# EAGLE board Proiect (EAGLE 9.7.0)
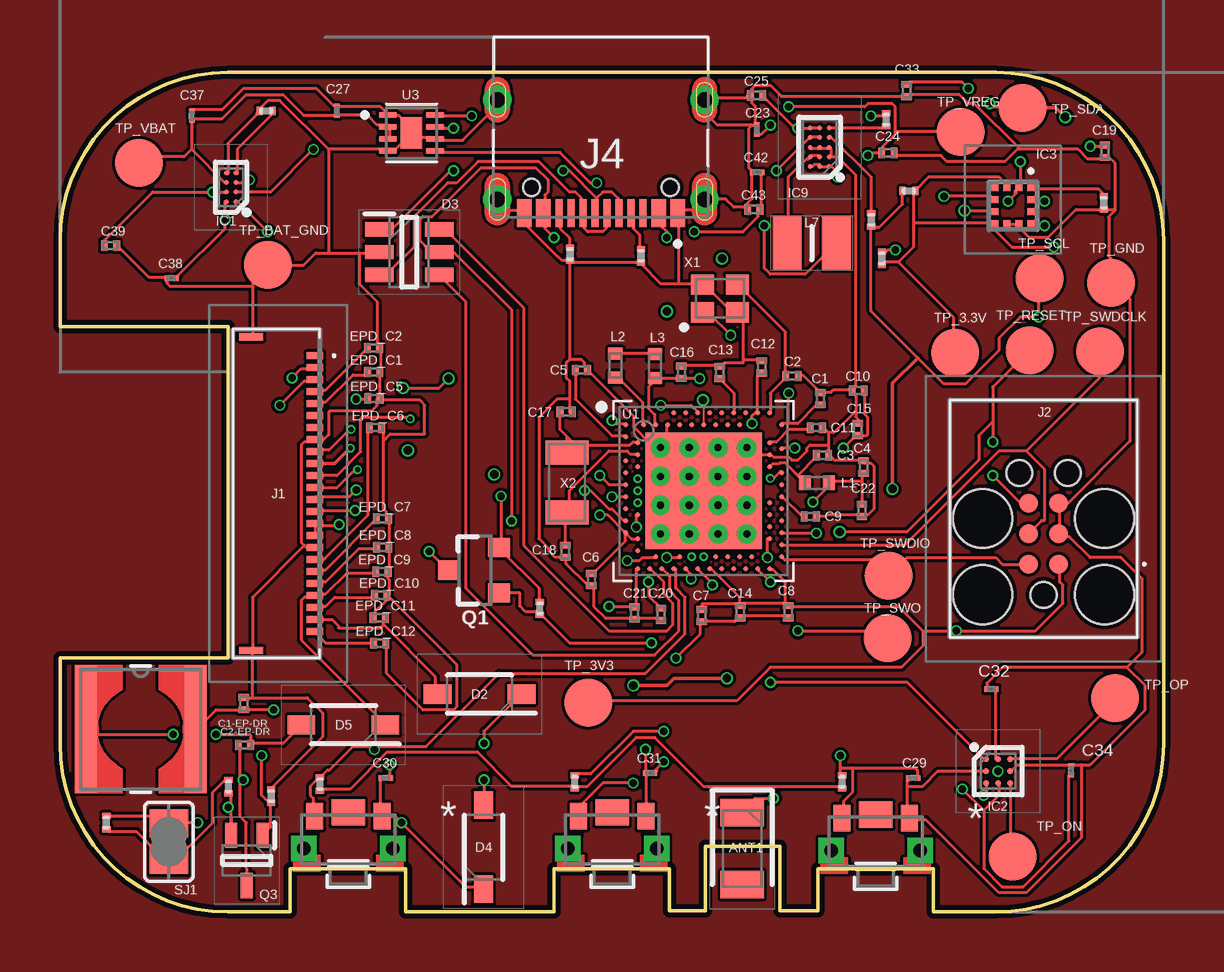
[diagram p2: board, top side]
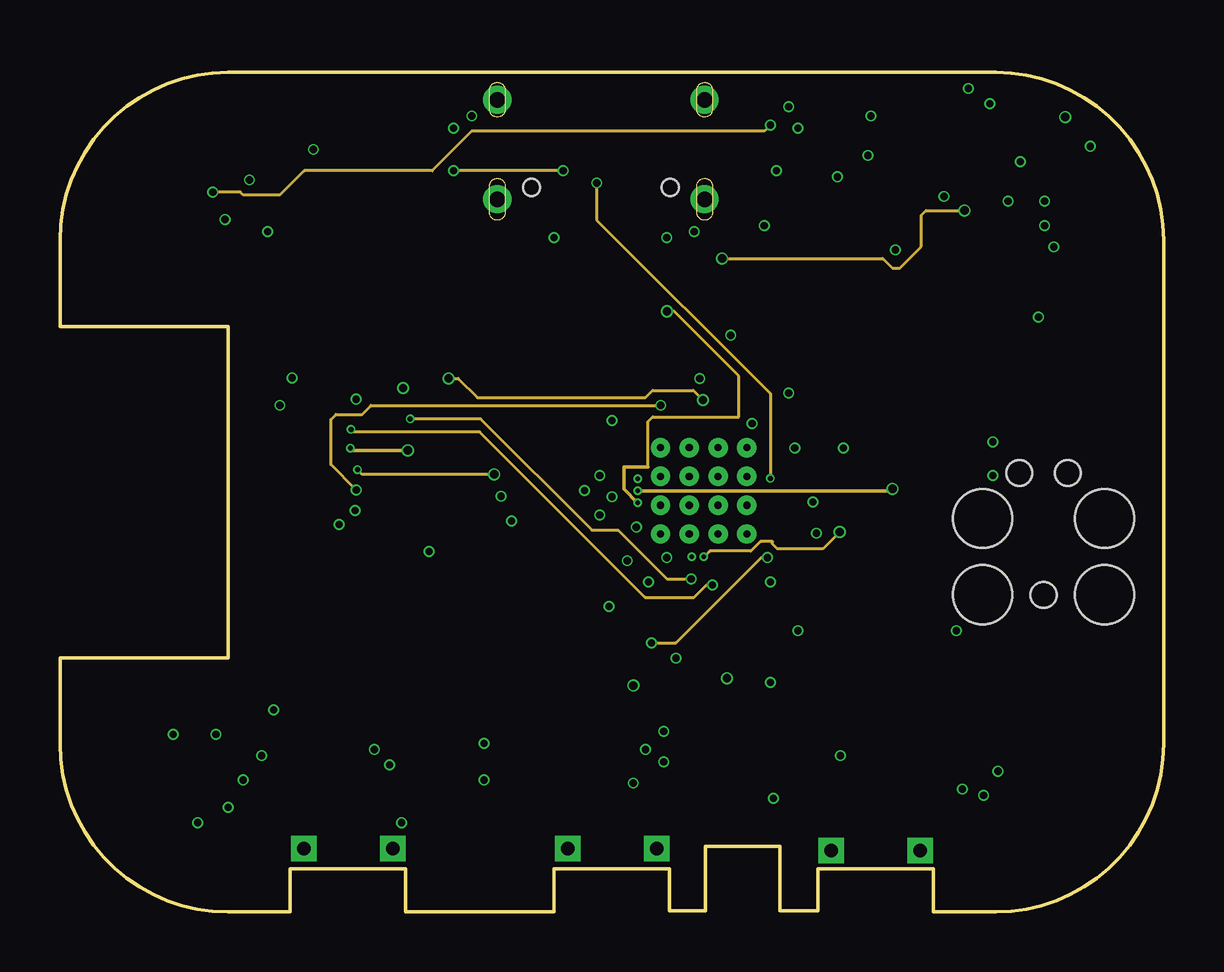
[diagram p3: board, inner layer Route2]
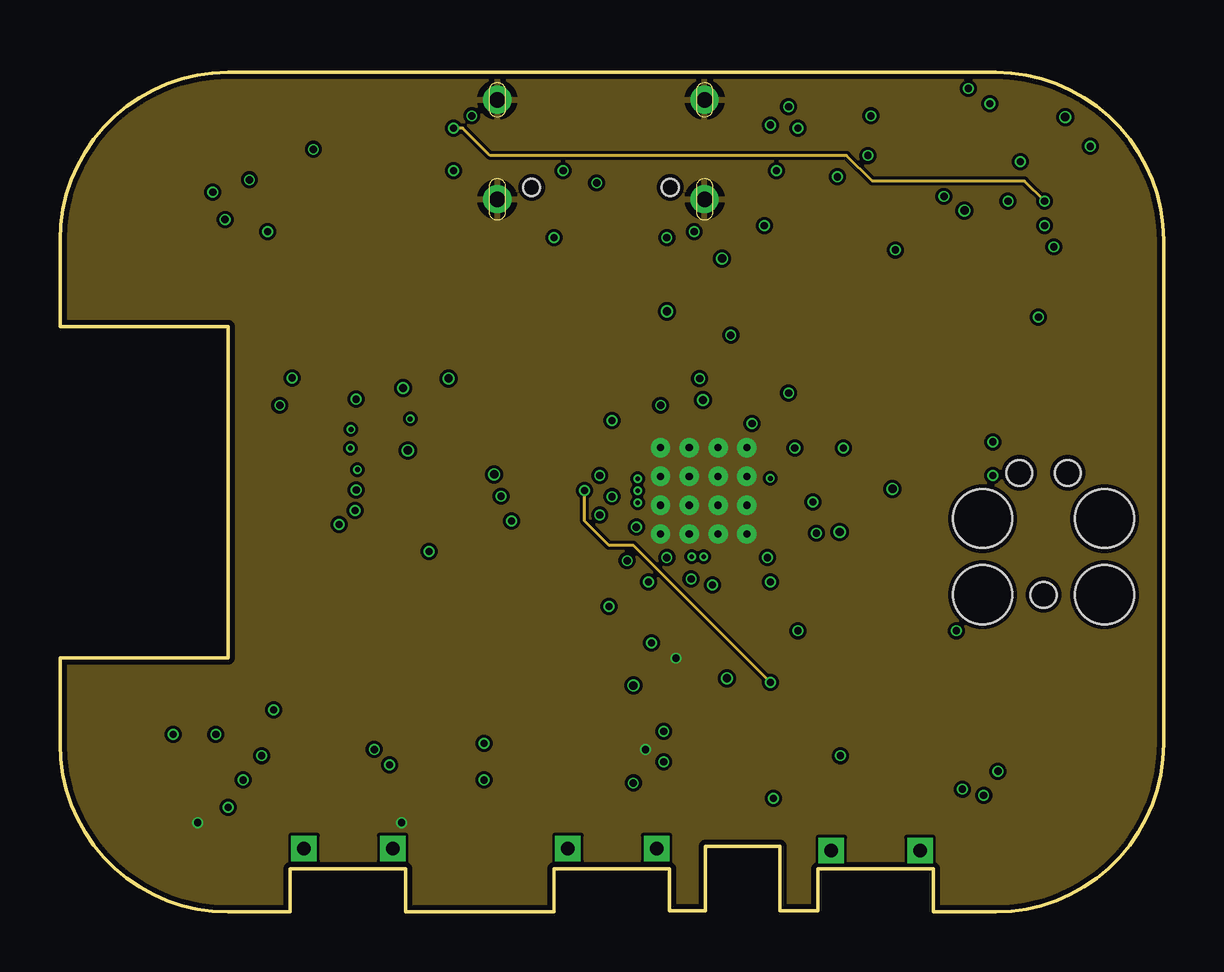
[diagram p4: board, inner layer Route15]
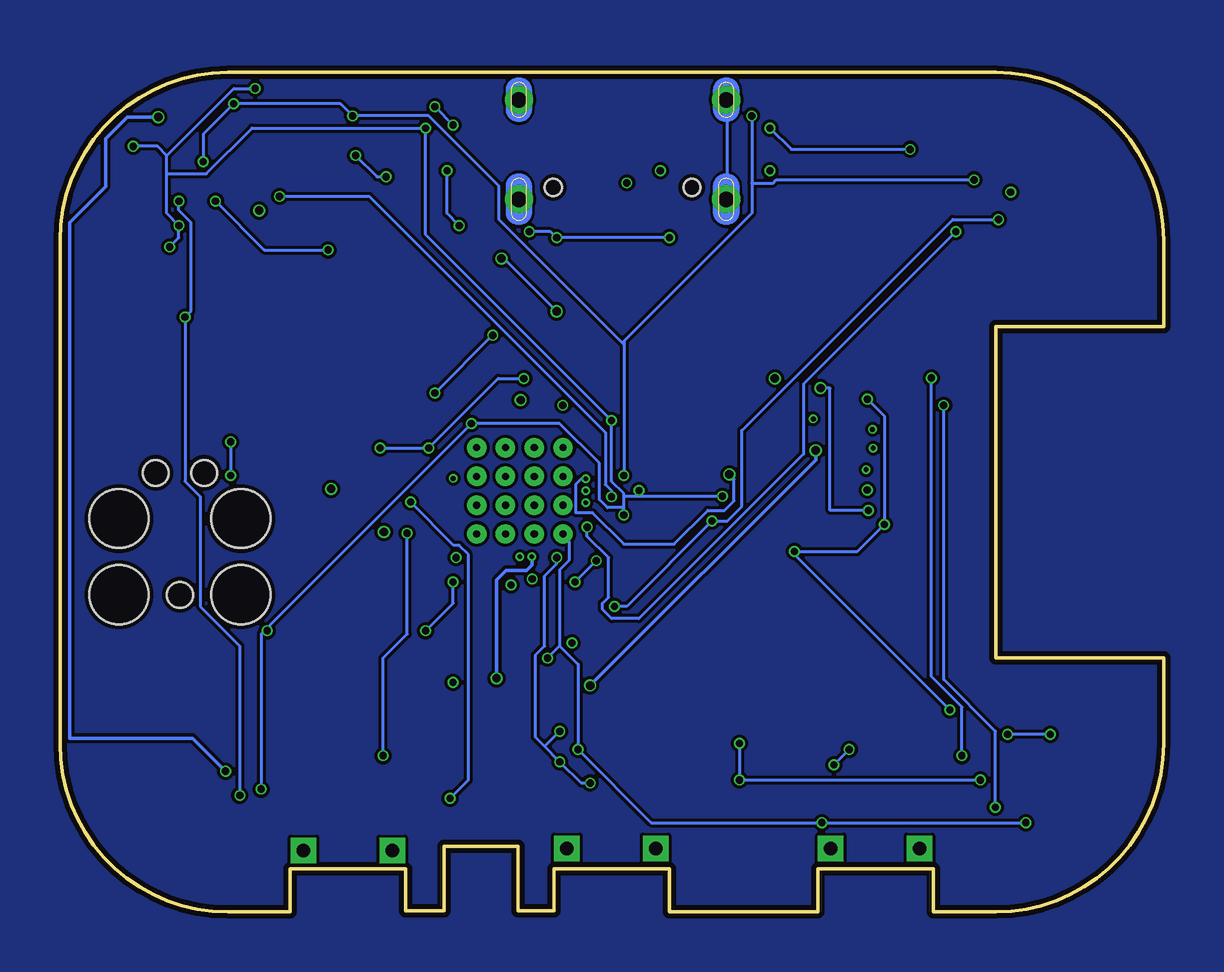
[diagram p5: board, bottom side, seen from below]

Size 46 x 35 mm. Coordinates in mm from the lower left corner, seen from the top.
Outline: 39,0 36.4,0 36.4,1.8 31.6,1.8 31.6,0.04 30,0.04 30,2.74 26.9,2.74 26.9,0.04 25.4,0.04 25.4,1.8 20.6,1.8 20.6,0 14.4,0 14.4,1.8 9.6,1.8 9.6,0 7,0 arc-90 0,7 0,10.6 7,10.6 7,24.4 0,24.4 0,28 arc-90 7,35 39,35 arc-90 46,28 46,7 arc-90 39,0
Copper layers (1+2*15+16): Top 0.035mm / dielectric 1.6mm / Route2 0.035mm / dielectric 0.15mm / Route15 0.035mm / dielectric 0.2mm / Bottom 0.035mm
Design rules "jlcpcb-2layers.dru *": minimum track width 5mil, minimum drill 0.3mm, track to track 5mil, track to pad 5mil, pad to pad 5mil, via to via 5mil, smd to smd 5mil, copper to edge 0.2mm, drill to drill 6mil, minimum pad ring 10mil, minimum via ring 3mil, stop-mask expansion 4mil, vias tented up to drill 0mil, thermal gap 10mil

## Footprints (pad centres in the part's own frame; a part is rotated, then mirrored left to right if it is on the bottom)
2450AT18B100E_ANTC3216X140N = smd 1.15 x 1.8: 1 -1.5,0; 2 1.5,0
NORDIC_NRF_3_RESC0201_L = smd 0.28 x 0.43: 1 -0.255,0; 2 0.255,0
GRM011R60J152KE01L_2_CAPC0201X13N = smd 0.22 x 0.23: 1 -0.185,0; 2 0.185,0
ESP32_C6_LIBRARY_5_SOD3716X135N = smd 1.15 x 0.8: 1 -1.75,0; 2 1.75,0
ESP32_C6_LIBRARY_3_SOT95P280X145-6N = smd 1.2 x 0.6: 1 -1.25,0.95; 2 -1.25,0; 3 -1.25,-0.95; 4 1.25,-0.95; 5 1.25,0; 6 1.25,0.95
BQ25180YBGR_BGA8C40P2X4_100X155X50 = smd 0.2 x 0.2: A1 -0.2,0.6; A2 0.2,0.6; B1 -0.2,0.2; B2 0.2,0.2; C1 -0.2,-0.2; C2 0.2,-0.2; D1 -0.2,-0.6; D2 0.2,-0.6
DRV2605YZFR_BGA9C50P3X3_144X144X62 = smd 0.25 x 0.25: A1 -0.5,0.5; A2 0,0.5; A3 0.5,0.5; B1 -0.5,0; B2 0,0; B3 0.5,0; C1 -0.5,-0.5; C2 0,-0.5; C3 0.5,-0.5
BMA423_BMA423 = smd 0.3 x 0.35: 1 -0.75,-0.775; 2 -0.25,-0.775; 3 0.25,-0.775; 4 0.75,-0.775; 7 0.75,0.775; 8 0.25,0.775; 9 -0.25,0.775; 10 -0.75,0.775 | smd 0.35 x 0.3: 5 0.775,-0.25; 6 0.775,0.25; 11 -0.775,0.25; 12 -0.775,-0.25
RT6160AWSC_BGA15C40P3X5_140X230X60 = smd 0.216 x 0.216: A1 -0.4,0.8; A2 0,0.8; A3 0.4,0.8; B1 -0.4,0.4; B2 0,0.4; B3 0.4,0.4; C1 -0.4,0; C2 0,0; C3 0.4,0; D1 -0.4,-0.4; D2 0,-0.4; D3 0.4,-0.4; E1 -0.4,-0.8; E2 0,-0.8; E3 0.4,-0.8
503480-2400_5034802400 = smd 0.3 x 0.7: 1 -5.75,1.525; 2 -5.25,1.525; 3 -4.75,1.525; 4 -4.25,1.525; 5 -3.75,1.525; 6 -3.25,1.525; 7 -2.75,1.525; 8 -2.25,1.525; 9 -1.75,1.525; 10 -1.25,1.525; 11 -0.75,1.525; 12 -0.25,1.525; 13 0.25,1.525; 14 0.75,1.525; 15 1.25,1.525; 16 1.75,1.525; 17 2.25,1.525; 18 2.75,1.525; 19 3.25,1.525; 20 3.75,1.525; 21 4.25,1.525; 22 4.75,1.525; 23 5.25,1.525; 24 5.75,1.525 | smd 0.3 x 1: MP1 -6.54,-1.125; MP2 6.54,-1.125
TC2030-IDC_TC2030IDC = smd 0.783 x 0.783: 1 -0.953,-0.635; 2 -0.953,0.635; 3 0.317,-0.635; 4 0.317,0.635; 5 1.588,-0.635; 6 1.588,0.635 | hole 2.451: -2.223,-2.54; -2.223,2.54; 0.952,-2.54; 0.952,2.54 | hole 1.067: -2.223,0; 2.857,-1.016; 2.857,1.016
KH-TYPE-C-16P_KINGHELM_KH-TYPE-C-16P = smd 0.6 x 1.15: A1_B12 -3.2,4.725; A4_B9 -2.4,4.725; A9_B4 2.4,4.725; A12_B1 3.2,4.725 | smd 0.3 x 1.15: A5 -1.25,4.725; A6 -0.25,4.725; A7 0.25,4.725; A8 1.25,4.725; B5 1.75,4.725; B6 0.75,4.725; B7 -0.75,4.725; B8 -1.75,4.725 | drill 0.65 pad 1.05: SH1 -4.32,0; SH2 4.32,0; SH3 -4.32,4.15; SH4 4.32,4.15 | hole 0.7: -2.89,3.65; 2.89,3.65
NORDIC_NRF_2_RESC0402_L = smd 0.5 x 0.6: 1 -0.5,0; 2 0.5,0
ESP32_C6_LIBRARY_2_IND_4828-WE-TPC_WRE = smd 0.9 x 5.3: 1 -2.286,0; 2 2.286,0
MLP2016SR47MT0S1_INDC2016X100N = smd 1.2 x 2.2: 1 -1.028,0; 2 1.028,0
ESP32_C6_LIBRARY_4_ESP32_C6_LIBRARY_4_ESP32_C6_LIBRARY_4_ESP32_C6_LIBRARY_4_ESP32_WROVER_SPARKFUN-DISCRETESEMI_SOT23-3 = smd 0.8 x 0.9: 1 -0.95,-1; 2 0.95,-1; 3 0,1.1
ESP32_C6_LIBRARY_6_SOT65P210X110-3N = smd 1.05 x 0.5: 1 -1.05,0.65; 2 -1.05,-0.65; 3 1.05,0
ERA-1AEB3401C_0201 = smd 0.35 x 0.25: 1 0,0.275; 2 0,-0.275
ESP32_C6_LIBRARY_7_JUMPER_SJ = smd 1.168 x 1.6: 1 -0.762,0; 2 0.762,0
2025-10-22_07-23-44_LIBRARY_SW_EVP-AKE31A_PAN = smd 0.711 x 1.092: 1 -1.4,-0.972; 2 1.4,-0.972 | drill 0.559 pad 0.914 square: 3 -1.848,0.381; 4 1.848,0.381 | smd 1.397 x 1.092: 5 0,-1.124
HECTOR_WATCH_1_TP20R = smd 2 x 2: TP 0,0
NORDIC_NRF_4_AQFN50P700X700X85_HS-74N = smd 4.85 x 4.85: P$74 0,0 | drill 0.3 pad 0.6: P$75 -1.8,1.8; P$76 -0.6,1.8; P$77 0.6,1.8; P$78 1.8,1.8; P$79 -1.8,0.6; P$80 -0.6,0.6; P$81 0.6,0.6; P$82 1.8,0.6; P$83 -1.8,-0.6; P$84 -0.6,-0.6; P$85 0.6,-0.6; P$86 1.8,-0.6; P$87 -1.8,-1.8; P$88 -0.6,-1.8; P$89 0.6,-1.8; P$90 1.8,-1.8 | smd 0.2 x 0.2: P$A8 -1.25,3.25; P$A10 -0.75,3.25; P$A12 -0.25,3.25; P$A14 0.25,3.25; P$A16 0.75,3.25; P$A18 1.25,3.25; P$A20 1.75,3.25; P$A22 2.25,3.25; P$A23 2.75,3.25; P$AA24 3.25,-2.25; P$AB2 -2.75,-2.5; P$AC5 -2,-2.75; P$AC9 -1,-2.75; P$AC11 -0.5,-2.75; P$AC13 0,-2.75; P$AC15 0.5,-2.75; P$AC17 1,-2.75; P$AC19 1.5,-2.75; P$AC21 2,-2.75; P$AC24 3.25,-2.75; P$AD2 -2.75,-3.25; P$AD4 -2.25,-3.25; P$AD6 -1.75,-3.25; P$AD8 -1.25,-3.25; P$AD10 -0.75,-3.25; P$AD12 -0.25,-3.25; P$AD14 0.25,-3.25; P$AD16 0.75,-3.25; P$AD18 1.25,-3.25; P$AD20 1.75,-3.25; P$AD22 2.25,-3.25; P$AD23 2.75,-3.25; P$B1 -3.25,2.75; P$B3 -2.5,2.75; P$B5 -2,2.75; P$B7 -1.5,2.75; P$B9 -1,2.75; P$B11 -0.5,2.75; P$B13 0,2.75; P$B15 0.5,2.75; P$B17 1,2.75; P$B19 1.5,2.75; P$B24 3.25,2.75; P$C1 -3.25,2.25; P$D2 -2.75,2; P$D23 2.75,2; P$E24 3.25,1.75; P$F2 -2.75,1.5; P$F23 2.75,1.5; P$G1 -3.25,1.25; P$H2 -2.75,1; P$H23 2.75,1; P$J1 -3.25,0.75; P$J24 3.25,0.75; P$K2 -2.75,0.5; P$L1 -3.25,0.25; P$L24 3.25,0.25; P$M2 -2.75,0; P$N1 -3.25,-0.25; P$N24 3.25,-0.25; P$P2 -2.75,-0.5; P$P23 2.75,-0.5; P$R1 -3.25,-0.75; P$R24 3.25,-0.75; P$T2 -2.75,-1; P$T23 2.75,-1; P$U1 -3.25,-1.25; P$U24 3.25,-1.25; P$V23 2.75,-1.5; P$W1 -3.25,-1.75; P$W24 3.25,-1.75; P$Y2 -2.75,-2; P$Y23 2.75,-2
ESP32_C6_LIBRARY_SON50P200X200X80-9N = smd 0.76 x 0.27: 1 -0.985,0.75; 2 -0.985,0.25; 3 -0.985,-0.25; 4 -0.985,-0.75; 5 0.985,-0.75; 6 0.985,-0.25; 7 0.985,0.25; 8 0.985,0.75 | smd 0.9 x 1.3: 9 0,0
NORDIC_NRF_BT-XTAL_2016_N = smd 0.95 x 0.85: 1 -0.725,-0.575; 2 0.725,-0.575; 3 0.725,0.575; 4 -0.725,0.575
NORDIC_NRF_1_XTAL_3215_N = smd 1 x 1.8: 1 -1.25,0; 2 1.25,0

## Placement (x,y rotation side)
ANT1  2450AT18B100E_2450AT18B100E  [2450AT18B100E_ANTC3216X140N]  28.44,2.64 270 top
C1  12pF  [NORDIC_NRF_3_RESC0201_L]  31.7,21.4 90 top
C1-EP-DR  10uF  [NORDIC_NRF_3_RESC0201_L]  7.67,8.69 90 top
C2  12pF  [NORDIC_NRF_3_RESC0201_L]  30.51,22.34 0 top
C2-EP-DR  4.7uF/25V  [NORDIC_NRF_3_RESC0201_L]  7.69,6.97 0 top
C3  1pF  [NORDIC_NRF_3_RESC0201_L]  31.79,19.04 0 top
C4  1pF  [NORDIC_NRF_3_RESC0201_L]  33.5,18.55 90 top
C5  100µF  [NORDIC_NRF_3_RESC0201_L]  21.73,22.59 0 top
C6  4.7µF  [NORDIC_NRF_3_RESC0201_L]  22.15,13.86 270 top
C7  100µF  [NORDIC_NRF_3_RESC0201_L]  26.75,12.36 270 top
C8  100µF  [NORDIC_NRF_3_RESC0201_L]  30.35,12.51 270 top
C9  820pF  [NORDIC_NRF_3_RESC0201_L]  31.28,16.49 0 top
C10  N.C  [NORDIC_NRF_3_RESC0201_L]  33.27,21.74 180 top
C11  100nF  [NORDIC_NRF_3_RESC0201_L]  31.53,20.19 0 top
C12  100nF  [NORDIC_NRF_3_RESC0201_L]  29.25,22.72 90 top
C13  N.C.  [NORDIC_NRF_3_RESC0201_L]  27.5,22.49 90 top
C14  4.7µF  [NORDIC_NRF_3_RESC0201_L]  28.35,12.51 270 top
C15  1.0µF  [NORDIC_NRF_3_RESC0201_L]  33.25,20.12 90 top
C16  47nF  [NORDIC_NRF_3_RESC0201_L]  25.9,22.5 90 top
C17  12µF  [NORDIC_NRF_3_RESC0201_L]  21.1,20.85 180 top
C18  12µF  [NORDIC_NRF_3_RESC0201_L]  21.06,15.04 90 top
C19  100uF  [NORDIC_NRF_3_RESC0201_L]  43.55,31.71 270 top
C20  4.7µF  [NORDIC_NRF_3_RESC0201_L]  25.05,12.41 270 top
C21  4.7µF  [NORDIC_NRF_3_RESC0201_L]  23.95,12.46 270 top
C22  N.C.  [NORDIC_NRF_3_RESC0201_L]  33.43,16.74 270 top
C23  GRM011R60J152KE01L_2_GRM011R60J152KE01L  [GRM011R60J152KE01L_2_CAPC0201X13N]  29.05,32.62 270 top
C24  10uF  [NORDIC_NRF_3_RESC0201_L]  34.51,31.64 180 top
C25  22uF  [NORDIC_NRF_3_RESC0201_L]  29.04,34.04 180 top
C27  GRM011R60J152KE01L_2_GRM011R60J152KE01L  [GRM011R60J152KE01L_2_CAPC0201X13N]  11.55,33.4 270 top
C29  GRM011R60J152KE01L_2_GRM011R60J152KE01L  [GRM011R60J152KE01L_2_CAPC0201X13N]  35.56,5.59 0 top
C30  GRM011R60J152KE01L_2_GRM011R60J152KE01L  [GRM011R60J152KE01L_2_CAPC0201X13N]  13.58,5.59 0 top
C31  GRM011R60J152KE01L_2_GRM011R60J152KE01L  [GRM011R60J152KE01L_2_CAPC0201X13N]  24.6,5.79 0 top
C32  GRM011R60J152KE01L_2_GRM011R60J152KE01L  [GRM011R60J152KE01L_2_CAPC0201X13N]  38.82,9.29 0 top
C33  22uF  [NORDIC_NRF_3_RESC0201_L]  35.29,34.24 270 top
C34  GRM011R60J152KE01L_2_GRM011R60J152KE01L  [GRM011R60J152KE01L_2_CAPC0201X13N]  42.15,5.9 270 top
C37  GRM011R60J152KE01L_2_GRM011R60J152KE01L  [GRM011R60J152KE01L_2_CAPC0201X13N]  5.49,33.19 270 top
C38  GRM011R60J152KE01L_2_GRM011R60J152KE01L  [GRM011R60J152KE01L_2_CAPC0201X13N]  4.65,26.41 0 top
C39  10µF  [NORDIC_NRF_3_RESC0201_L]  2.11,27.78 0 top
C42  GRM011R60J152KE01L_2_GRM011R60J152KE01L  [GRM011R60J152KE01L_2_CAPC0201X13N]  29.06,30.83 0 top
C43  4.7uF  [NORDIC_NRF_3_RESC0201_L]  28.92,29.29 180 top
D2  ESP32_C6_LIBRARY_5_MBR0530  [ESP32_C6_LIBRARY_5_SOD3716X135N]  17.49,9.08 180 top
D3  ESP32_C6_LIBRARY_3_USBLC6-2SC6Y  [ESP32_C6_LIBRARY_3_SOT95P280X145-6N]  14.56,27.51 0 top
D4  ESP32_C6_LIBRARY_5_MBR0530  [ESP32_C6_LIBRARY_5_SOD3716X135N]  17.66,2.7 90 top
D5  ESP32_C6_LIBRARY_5_MBR0530  [ESP32_C6_LIBRARY_5_SOD3716X135N]  11.82,7.8 180 top
EPD_C1  1uF/50V  [NORDIC_NRF_3_RESC0201_L]  13.08,22.51 180 top
EPD_C2  1uF/50V  [NORDIC_NRF_3_RESC0201_L]  13.07,23.51 180 top
EPD_C5  0.1uF/50V  [NORDIC_NRF_3_RESC0201_L]  13.09,21.41 180 top
EPD_C6  1uF/50V  [NORDIC_NRF_3_RESC0201_L]  13.15,20.19 180 top
EPD_C7  1uF/50V  [NORDIC_NRF_3_RESC0201_L]  13.44,16.39 180 top
EPD_C8  1uF/50V  [NORDIC_NRF_3_RESC0201_L]  13.45,15.21 180 top
EPD_C9  1uF/50V  [NORDIC_NRF_3_RESC0201_L]  13.42,14.19 180 top
EPD_C10  1uF/50V  [NORDIC_NRF_3_RESC0201_L]  13.37,13.21 180 top
EPD_C11  1uF/50V  [NORDIC_NRF_3_RESC0201_L]  13.31,12.27 0 top
EPD_C12  1uF/50V  [NORDIC_NRF_3_RESC0201_L]  13.33,11.21 180 top
IC1  BQ25180YBGR_BQ25180YBGR  [BQ25180YBGR_BGA8C40P2X4_100X155X50]  7.13,30.21 180 top
IC2  DRV2605YZFR_DRV2605YZFR  [DRV2605YZFR_BGA9C50P3X3_144X144X62]  39.1,5.87 0 top
IC3  BMA423_BMA423  [BMA423_BMA423]  39.72,29.44 180 top
IC9  RT6160AWSC_RT6160AWSC  [RT6160AWSC_BGA15C40P3X5_140X230X60]  31.67,31.88 180 top
J1  503480-2400_503480-2400  [503480-2400_5034802400]  9.1,17.44 270 top
J2  TC2030-IDC_TC2030-IDC  [TC2030-IDC_TC2030IDC]  41,15.45 90 top
J4  KH-TYPE-C-16P_KH-TYPE-C-16P  [KH-TYPE-C-16P_KINGHELM_KH-TYPE-C-16P]  22.55,33.86 180 top
L1  3.9nH  [NORDIC_NRF_2_RESC0402_L]  31.56,17.89 0 top
L2  10µH  [NORDIC_NRF_2_RESC0402_L]  23.15,22.77 90 top
L3  15nH  [NORDIC_NRF_2_RESC0402_L]  24.8,22.75 270 top
L5  ESP32_C6_LIBRARY_2_744043680IND_4828-WE-TPC_WRE  [ESP32_C6_LIBRARY_2_IND_4828-WE-TPC_WRE]  3.37,7.62 0 top
L7  MLP2016SR47MT0S1_FTC252012SR47MBCA  [MLP2016SR47MT0S1_INDC2016X100N]  31.34,27.88 0 top
Q1  20V/4.2A/52mΩ/1.4W  [ESP32_C6_LIBRARY_4_ESP32_C6_LIBRARY_4_ESP32_C6_LIBRARY_4_ESP32_C6_LIBRARY_4_ESP32_WROVER_SPARKFUN-DISCRETESEMI_SOT23-3]  17.3,14.25 90 top
Q3  ESP32_C6_LIBRARY_6_SI1308EDL-T1-GE3  [ESP32_C6_LIBRARY_6_SOT65P210X110-3N]  7.79,2.15 270 top
R1_EP_DR  ERA-1AEB3401C_CPF0201D7K68C1  [ERA-1AEB3401C_0201]  7.02,5.23 0 top
R1_USB  ERA-1AEB3401C_CPF0201D7K68C1  [ERA-1AEB3401C_0201]  24.22,27.35 180 top
R2  ERA-1AEB3401C_CPF0201D7K68C1  [ERA-1AEB3401C_0201]  34.44,33.03 0 top
R2_EP_DR1  ERA-1AEB3401C_CPF0201D7K68C1  [ERA-1AEB3401C_0201]  8.8,4.83 0 top
R2_USB  ERA-1AEB3401C_CPF0201D7K68C1  [ERA-1AEB3401C_0201]  21.26,27.43 0 top
R3  ERA-1AEB3401C_CPF0201D7K68C1  [ERA-1AEB3401C_0201]  43.51,29.56 180 top
R4  ERA-1AEB3401C_CPF0201D7K68C1  [ERA-1AEB3401C_0201]  33.82,28.85 180 top
R5  ERA-1AEB3401C_CPF0201D7K68C1  [ERA-1AEB3401C_0201]  10.84,5.33 0 top
R7  ERA-1AEB3401C_CPF0201D7K68C1  [ERA-1AEB3401C_0201]  32.6,5.43 0 top
R8  ERA-1AEB3401C_CPF0201D7K68C1  [ERA-1AEB3401C_0201]  21.46,5.43 0 top
R9  ERA-1AEB3401C_CPF0201D7K68C1  [ERA-1AEB3401C_0201]  8.59,33.4 90 top
R17  ERA-1AEB3401C_CPF0201D7K68C1  [ERA-1AEB3401C_0201]  35.39,30.06 270 top
R18  ERA-1AEB3401C_CPF0201D7K68C1  [ERA-1AEB3401C_0201]  34.26,27.25 180 top
R_PWR_EPD  ERA-1AEB3401C_CPF0201D7K68C1  [ERA-1AEB3401C_0201]  20,12.65 180 top
R_TYPE_SEL  ERA-1AEB3401C_CPF0201D7K68C1  [ERA-1AEB3401C_0201]  1.93,3.73 0 top
SJ1  [ESP32_C6_LIBRARY_7_JUMPER_SJ]  4.54,2.93 270 top
SW_DN  2025-10-22_07-23-44_LIBRARY_EVP-AKE31ASW_EVP-AKE31A_PAN  [2025-10-22_07-23-44_LIBRARY_SW_EVP-AKE31A_PAN]  34,2.94 180 top
SW_ENT  2025-10-22_07-23-44_LIBRARY_EVP-AKE31ASW_EVP-AKE31A_PAN  [2025-10-22_07-23-44_LIBRARY_SW_EVP-AKE31A_PAN]  23.02,3.03 180 top
SW_UP  2025-10-22_07-23-44_LIBRARY_EVP-AKE31ASW_EVP-AKE31A_PAN  [2025-10-22_07-23-44_LIBRARY_SW_EVP-AKE31A_PAN]  12.02,3.03 180 top
TP_3.3V  HECTOR_WATCH_1_TPTP20R  [HECTOR_WATCH_1_TP20R]  37.32,23.32 0 top
TP_3V3  HECTOR_WATCH_1_TPTP20R  [HECTOR_WATCH_1_TP20R]  22.02,8.72 0 top
TP_BAT_GND  HECTOR_WATCH_1_TPTP20R  [HECTOR_WATCH_1_TP20R]  8.66,26.97 0 top
TP_GND  HECTOR_WATCH_1_TPTP20R  [HECTOR_WATCH_1_TP20R]  43.81,26.22 0 top
TP_ON  HECTOR_WATCH_1_TPTP20R  [HECTOR_WATCH_1_TP20R]  39.7,2.32 0 top
TP_OP  HECTOR_WATCH_1_TPTP20R  [HECTOR_WATCH_1_TP20R]  43.98,8.92 0 top
TP_RESET  HECTOR_WATCH_1_TPTP20R  [HECTOR_WATCH_1_TP20R]  40.41,23.42 0 top
TP_SCL  HECTOR_WATCH_1_TPTP20R  [HECTOR_WATCH_1_TP20R]  40.84,26.42 0 top
TP_SDA  HECTOR_WATCH_1_TPTP20R  [HECTOR_WATCH_1_TP20R]  40.13,33.52 0 top
TP_SWDCLK  HECTOR_WATCH_1_TPTP20R  [HECTOR_WATCH_1_TP20R]  43.36,23.37 0 top
TP_SWDIO  HECTOR_WATCH_1_TPTP20R  [HECTOR_WATCH_1_TP20R]  34.54,14.02 0 top
TP_SWO  HECTOR_WATCH_1_TPTP20R  [HECTOR_WATCH_1_TP20R]  34.5,11.42 0 top
TP_VBAT  HECTOR_WATCH_1_TPTP20R  [HECTOR_WATCH_1_TP20R]  3.29,31.22 0 top
TP_VREG  HECTOR_WATCH_1_TPTP20R  [HECTOR_WATCH_1_TP20R]  37.55,32.52 0 top
U1  NORDIC_NRF_4_NRF52840_QF  [NORDIC_NRF_4_AQFN50P700X700X85_HS-74N]  26.83,17.56 0 top
U3  ESP32_C6_LIBRARY_MAX17048G+T10  [ESP32_C6_LIBRARY_SON50P200X200X80-9N]  14.65,32.48 0 top
X1  32MHz  [NORDIC_NRF_BT-XTAL_2016_N]  27.51,25.58 0 top
X2  32.768kHz  [NORDIC_NRF_1_XTAL_3215_N]  21.14,17.9 270 top

## Tracks (layer width: path | path; a pad name or v marks a point on that pad's centre or on a via)
3V3  (via drill 0.3)
  Top 0.127: U1.P$AD14 27.12,14.35 28.34,13.12 C14.1 | C14.1 28.27,12.84 26.75,12.84 C7.1 | 30.25,12.87 30.25,13.76 29.74,14.27 29.58,14.27 U1.P$AD23 | 35.96,11.73 v37.36,11.73 40.66,11.73 41.8,12.87 41.8,13.63 41.68,13.76 41.68,14.46 J2.1 | 35.96,11.73 34.95,12.74 30.37,12.74 C8.1 30.25,12.87 | 30.25,12.87 28.45,12.87 C14.1 | 35.96,11.73 35.96,11.09 35.07,10.2 29.61,10.2 28.21,8.8 22.1,8.8 TP_3V3.TP | IC9.E2 IC9.E3 v30.76,32.68 30.63,32.68 29.3,34.01 C25.1 | 34.95,27.09 34.38,27.09 R18.1 | 34.95,27.09 35.58,27.73 35.58,28.74 | 35.58,28.74 35.58,29.91 35.66,30 R17.1 35.65,30.08 36.22,30.65 39.14,30.65 39.47,30.32 IC3.3 | 35.58,28.74 38.79,28.74 38.87,28.66 IC3.7 38.97,28.43 39.67,27.73 v41.42,27.73 | v41.04,28.62 40.52,28.62 IC3.10 | v37.87,34.33 37.61,34.59 35.38,34.59 C33.1 | v42.95,31.92 43.5,31.92 C19.1 | 34.95,27.09 37.23,24.81 37.23,23.32 TP_3.3V.TP | 38.5,4.23 38.5,1.82 39.26,1.06 40.15,1.06 42.06,2.96 42.06,5.72 C34.2 | 38.5,4.23 39.14,4.87 39.14,5.33 IC2.C2 | R_PWR_EPD.2 19.96,12.97 19.96,13.5 18.3,15.16 Q1.2 18.38,15.28 v18.38,17.33 | C12.1 29.08,22.3 U1.P$A22 28.97,20.81 28.85,20.69 v28.85,20.36 | v23.01,20.49 23.14,20.36 23.53,20.36 U1.P$B1 | v22.5,16.55 22.84,16.55 U1.P$W1 | C6.1 22.22,14.12 23.58,15.47 U1.P$W1 | v37.61,5.12 38.5,4.23 | U1.P$W1 23.83,15.56 U1.P$Y2
  Bottom 0.127: v41.42,27.73 41.04,28.11 v41.04,28.62 41.55,29.12 41.55,30.78 | v37.87,34.33 38.76,34.33 41.55,31.54 | 41.55,30.78 41.55,31.54 | v42.95,31.92 41.93,31.92 41.55,31.54 | 41.55,30.78 39.9,30.78 37.99,32.68 v30.76,32.68 30.76,28.23 v23.01,20.49 23.01,17.95 22.5,17.44 22.5,17.33 | v22.5,16.55 22.5,16.94 | 22.5,16.94 22.5,17.33 | 22.5,17.33 v18.38,17.33 | v37.61,5.12 37.61,11.6 37.36,11.85 | 37.36,11.85 v28.85,20.36 25.17,20.36 23.52,18.71 23.52,17.19 23.18,16.86 22.59,16.86 22.5,16.94 | 37.36,11.85 v37.36,11.73
3V3/1.7D
  Top 0.127: R5.2 10.91,5.12 12.09,5.12 13.61,6.65 17.42,6.65 18.82,5.25 21.37,5.25 R8.2 21.46,5.25 21.99,5.25 24.02,7.28 24.79,7.28 26.82,5.25 32.6,5.25 R7.2
ALERT  (via drill 0.2, 0.3)
  Top 0.127: v29.61,18.08 29.74,18.08 30.03,18.36 U1.P$J24 | v22.37,30.39 22.12,30.39 20.85,31.66 15.7,31.66 U3.5
  Route2 0.127: v29.61,18.08 29.61,21.6 22.37,28.84 v22.37,30.39
D+
  Top 0.127: U1.P$AD6 25.12,14.31 25.42,14.01 25.42,13.38 25.8,13 25.8,11.73 24.79,10.71 19.71,10.71 16.91,13.5 16.91,25.44 15.81,26.54 D3.4
D-
  Top 0.127: U1.P$AD4 24.61,14.31 25.17,13.76 25.17,13.25 25.55,12.87 25.55,11.98 25.29,11.73 22.88,11.73 19.32,15.28 19.32,25.19 16.15,28.36 15.81,28.36 D3.6
DEC1
  Top 0.127: U1.P$C1 23.54,19.85 23.01,19.85 21.48,21.38 C5.1
DEC4_6  (via drill 0.3)
  Top 0.127: U1.P$B5 24.79,20.35 24.79,20.74 24.53,21 24.53,21.89 24.8,22.15 L3.2 24.82,22.27 25.88,22.27 C16.1 v26.66,22.24 | v30.63,19.35 30.12,19.35 U1.P$E24 | v32.66,19.35 33.18,19.87 C15.1 33.63,19.87 33.68,19.91 33.68,20.62 33.55,20.74 33.55,21.72 C10.1
  Bottom 0.127: v32.66,19.35 v30.63,19.35 27.73,22.24 v26.66,22.24
DN  (via drill 0.3)
  Top 0.127: 22.37,29.76 22.37,29.21 J4.A7 | 22.37,29.76 22.63,30.01 23.01,30.01 23.26,29.76 23.26,29.58 23.3,29.54 | 23.3,29.64 23.3,29.54 | 23.3,29.54 J4.B7 | v16.4,30.9 16.28,30.9 13.86,28.49 13.34,28.49 D3.1 | v20.98,30.9 21.23,30.9 22.37,29.76
  Route2 0.127: v20.98,30.9 v16.4,30.9
DP
  Top 0.127: J4.A6 22.75,29.14 22.75,28.49 22.63,28.36 21.99,28.36 21.86,28.49 21.86,29.14 J4.B6 21.74,29.2 21.74,29.76 21.48,30.01 21.23,30.01 19.96,31.28 17.42,31.28 16.53,30.39 16.15,30.39 14.75,29 14.75,27.73 13.61,26.58 13.33,26.58 D3.3
EPD_3V3  (via drill 0.3)
  Top 0.127: L5.2 5.7,7.62 6.51,8.44 C1-EP-DR.1 7.77,8.44 7.78,8.42 v8.91,8.42 | v12.34,21.38 12.8,21.38 EPD_C5.2 | v11.64,16.16 11.58,16.1 10.72,16.1 J1.15 J1.16 | v15.39,15.03 16.16,14.25 Q1.3
  Bottom 0.127: v12.34,21.38 11.64,20.68 v11.64,16.16 12.77,15.03 v15.39,15.03 15.39,14.9 v8.91,8.42
EPD_BUSY  (via drill 0.2, 0.3)
  Top 0.127: v27.2,13.63 27.2,13.69 U1.P$AD12 | J1.9 10.78,19.19 10.85,19.26 11.21,19.26 12.07,20.12 v12.13,20.12
  Route2 0.127: v27.2,13.63 26.95,13.63 26.44,13.12 24.39,13.12 17.49,20.02 12.23,20.02 v12.13,20.12
EPD_CS  (via drill 0.2, 0.35)
  Top 0.127: J1.12 11.55,17.69 12.3,18.44 v12.4,18.44
  Route2 0.127: v18.1,18.24 12.6,18.24 v12.4,18.44
  Bottom 0.127: U1.P$K2 24.28,18.06 24.5,17.84 24.5,16.64 23.8,16.64 22.5,15.34 20.4,15.34 19,16.74 18.3,16.74 17.9,17.14 17.9,18.04 v18.1,18.24
  other vias: 24.08,18.06
EPD_DC  (via drill 0.2, 0.3)
  Top 0.127: U1.P$AD10 26.31,14.08 v26.31,13.88 | v14.6,20.55 14.51,20.64 12.62,20.64 12.54,20.56 12.54,19.19 11.55,18.2 | 11.52,18.2 11.55,18.2 | J1.11 11.54,18.19 11.55,18.2
  Route2 0.127: v26.31,13.88 25.29,13.88 23.26,15.92 22.18,15.92 17.54,20.55 v14.6,20.55
EPD_RST  (via drill 0.2, 0.35)
  Top 0.152: J1.10 11.45,18.69 v12.1,19.34 | v27.8,9.74 25.6,9.74 25.3,9.44 v23.9,9.44
  Route2 0.152: v14.5,19.24 12.2,19.24 v12.1,19.34
  Bottom 0.152: U1.P$AC11 26.33,14.47 26.56,14.24 27.4,14.24 27.8,13.84 v27.8,9.74 | v23.9,9.44 14.5,18.84 v14.5,19.24
  other vias: 26.33,14.81
GDR  (via drill 0.3)
  Top 0.127: 8.78,4.49 8.78,3.54 Q3.1 | v9.67,22.27 10.05,22.65 10.58,22.65 J1.2 | v8.4,6.52 8.4,4.87 8.78,4.49 | 8.78,4.49 8.78,4.54 R2_EP_DR1.2
  Bottom 0.127: v9.67,22.27 9.67,9.82 8.4,8.55 v8.4,6.52
GND  (via drill 0.3)
  Top 0.127: 33.5,16.55 31.95,16.55 31.89,16.49 C9.2 | 32.02,19.98 32.02,19.47 | 32.02,19.47 32.02,19.06 C3.2 32.08,19.04 32.28,18.84 33.47,18.84 C4.2 33.5,18.71 33.8,18.71 33.93,18.58 33.93,16.8 33.68,16.55 33.5,16.55 | 32.02,19.98 31.81,20.19 C11.2 | 33.5,16.55 C22.2 | IC9.C3 31.33,31.82 31.61,31.82 IC9.C2 31.73,31.82 32.01,31.82 IC9.C1 32.12,31.83 32.12,31.54 IC9.B1 32.4,31.48 33.17,30.71 33.17,21.89 33.02,21.74 C10.2 | C2.2 30.79,22.37 30.99,22.37 C1.2 32.14,21.66 32.14,21.69 32.21,21.76 33,21.76 C10.2 | 33.17,20.89 33.17,21.5 33.02,21.66 C10.2 | 33.17,20.89 33.17,20.64 33.25,20.56 C15.2 | 32.02,19.98 32.26,19.98 33.17,20.89 | 24.99,19.42 25.03,19.46 | 25.03,19.46 25.29,19.73 25.29,20.27 U1.P$B7 | 25.03,19.46 U1.P$75 24.92,19.47 24.66,19.47 23.9,20.23 23.9,20.68 C5.2 21.89,22.69 21.86,22.69 21.86,22.9 21.74,23.03 21.23,23.03 | 26.31,17.04 U1.P$84 | U1.P$82 | U1.P$77 | C30.1 13.36,5.55 13.36,4.07 SW_UP.1 13.44,3.98 13.99,3.98 v14.24,3.72 16.91,1.06 17.55,1.06 D4.1 | C8.2 30.35,12.36 28.45,12.36 C14.2 28.26,12.26 28.12,12.11 26.82,12.11 26.79,12.14 C7.2 26.69,12.05 26.69,11.6 v25.68,10.58 | SW_ENT.1 C31.1 24.41,5.8 v24.41,6.77 | v5.74,3.72 4.57,3.72 SJ1.1 4.5,3.69 4.21,3.98 1.96,3.98 R_TYPE_SEL.1 | 25.03,15.79 U1.P$87 | 32.02,19.47 31.26,19.47 31.14,19.35 31.14,19.22 30.76,18.84 30.5,18.84 30.37,18.96 29.75,18.96 29.65,19.06 U1.P$F23 28.93,19.06 U1.P$78 | 13.74,13.12 13.65,13.21 EPD_C10.1 13.74,13.21 13.74,13.84 13.68,13.9 EPD_C9.1 13.74,14.25 13.74,15.24 | 13.74,13.12 16.53,10.33 16.53,8.55 16.4,8.42 15.13,8.42 13.61,9.95 13.61,11.19 EPD_C12.1 | 13.74,13.12 13.1,12.49 13.1,12.32 EPD_C11.1
  Top 0.127: 13.74,15.24 13.74,16.35 EPD_C7.1 13.61,16.39 13.61,16.68 13.48,16.8 13.48,19.64 | 13.74,15.24 EPD_C8.1 | 13.48,19.64 13.48,20.19 EPD_C6.1 | 8.02,8.93 7.68,8.93 C1-EP-DR.2 | 8.02,8.93 10.31,8.93 10.94,8.3 10.94,7.31 8.8,5.16 R2_EP_DR1.1 | 8.02,8.93 8.02,10.9 | 10.18,15.28 10.05,15.41 10.05,19.47 10.18,19.6 10.62,19.6 J1.8 10.99,19.69 11.2,19.9 11.2,20.84 11.26,20.9 13,20.9 13.23,21.12 13.23,21.24 | 10.18,15.28 10.26,15.2 | 10.26,15.2 10.33,15.13 10.43,15.23 | 13.23,21.24 13.23,21.41 EPD_C5.1 13.34,21.42 EPD_C1.1 13.36,22.51 13.36,23.48 EPD_C2.1 13.23,23.51 13.23,25.44 12.47,26.2 12.47,27.47 | 8.02,10.9 8.02,13.12 10.18,15.28 | 8.02,10.9 J1.MP2 | 35.33,5.25 35.33,3.91 SW_DN.1 35.4,3.85 36.09,3.85 39.14,0.8 40.28,0.8 42.57,3.09 42.57,6.14 | 35.33,5.25 35.33,5.44 35.38,5.49 C29.1 | 35.33,5.25 35.96,5.25 36.6,5.88 38.59,5.88 IC2.B1 | 44.47,10.2 39.29,10.2 38.63,9.54 C32.1 | 44.47,10.2 45.23,9.44 45.23,8.42 42.95,6.14 42.57,6.14 | 42.19,6.14 42.3,6.14 | 42.3,6.14 42.57,6.14 | 44.47,10.2 45.11,10.84 45.11,13.88 44.22,14.77 42.95,14.77 42.08,15.64 41.8,15.64 41.65,15.79 | 43.96,29.34 43.96,31.23 43.74,31.46 C19.2 43.5,31.41 42.82,31.41 42.44,31.79 40.03,31.79 | 43.96,29.34 43.96,29.23 43.71,28.98 43.71,27.34 43.81,27.24 43.81,26.34 | 40.03,31.79 39.9,31.79 39.39,31.28 36.98,31.28 36.72,31.54 34.87,31.54 C24.1 | 40.03,31.79 38.12,33.7 37.87,33.7 37.49,34.08 35.38,34.08 C33.2 35.29,34 30.07,34 29.61,34.46 28.98,34.46 28.85,34.33 28.85,34.04 | 4.42,26.46 3.7,26.46 2.38,27.78 C39.2 | 4.42,26.46 4.47,26.46 | 8.02,26.08 8.02,26.43 8.12,26.43 TP_BAT_GND.TP 10.16,26.97 10.66,27.47 11.2,27.47
  Top 0.127: 8.02,26.08 8.02,24.03 J1.MP1 | 11.2,27.47 12.47,27.47 | 12.47,27.47 13.27,27.47 D3.2 | 4.47,26.33 4.47,26.2 | 4.47,26.2 4.59,26.08 8.02,26.08 | C37.1 5.42,33.44 6.75,33.44 7.64,34.33 10.69,34.33 11.45,33.57 11.57,33.57 | 8.28,33.31 8.2,33.24 | 8.2,33.24 7.01,32.05 7.01,30.78 6.96,30.78 IC1.D2 | 13.66,31.79 13.99,31.79 14.65,32.45 U3.9 | U3.9 14.7,32.48 14.88,32.3 15.57,32.3 U3.6 15.63,32.17 16.79,32.17 18.07,33.46 18.23,33.46 J4.SH2 | U3.9 14.65,32.68 14.14,33.19 13.71,33.19 U3.1 13.66,33.26 13.36,33.57 11.57,33.57 | 11.2,31.79 9.16,33.82 8.66,33.82 8.4,33.57 8.4,33.44 8.36,33.4 R9.1 8.2,33.29 8.2,33.24 | 13.66,31.79 11.2,31.79 | 13.66,31.79 U3.4 | 28.5,29.38 28.85,29.73 28.85,30.8 C42.1 28.88,30.88 28.72,31.03 28.72,32.68 28.85,32.81 28.98,32.81 28.98,33.6 28.85,33.72 28.85,34.04 | 28.5,29.38 28.09,29.38 27.77,29.7 27.77,29.71 J4.SH3 26.87,29.68 26.44,29.25 25.75,29.25 J4.A1_B12 25.8,29.14 25.8,26.2 | 28.5,29.38 28.66,29.38 C43.2 | C23.1 27.4,32.8 26.87,33.34 J4.SH1 26.87,33.95 28.59,33.95 28.68,34.04 C25.2 28.85,34.04 | 27.58,22.77 27.5,22.77 | 27.5,22.77 25.92,22.77 C16.2 | 27.5,22.77 C13.2 27.55,22.75 27.58,22.77 | C12.2 29.22,23 28.47,23 | 27.58,22.77 27.71,22.9 28.47,22.9 28.47,23 | 28.47,23 28.47,24.81 28.27,25.01 X1.2 28.23,25.06 27.96,25.06 26.79,26.24 X1.4 26.74,26.2 25.8,26.2 | C20.2 25.05,12.23 23.98,12.23 C21.2 23.92,12.23 22.75,12.23 22.25,12.74 22.25,13.51 C6.2 22.02,13.61 21.1,14.52 21.1,14.79 C18.1 20.64,14.79 20.38,15.05 20.38,15.14 19.96,15.56 19.96,20.62 20.72,21.38 21.23,21.38 | 21.23,21.38 21.23,22.14 21.1,22.27 21.1,22.9 21.23,23.03
  Top 0.127: 21.23,21.38 21.23,20.85 C17.1 | J4.SH4 18.31,29.71 18.31,29.63 18.69,29.25 19.13,29.25 19.25,29.14 J4.A12_B1 19.45,29.14 19.45,28.62 20.75,27.32 20.92,27.16 R2_USB.2 | R2_USB.2 21.34,27.08 R1_USB.1 24.22,27.02 25.04,26.2 25.8,26.2 | 21.23,23.03 21.23,27.12 R2_USB.2 | 11.2,31.79 11.2,27.47 | 13.23,21.24 13.33,21.34 15,21.34 15.21,21.13 15.21,19.93 13.77,19.93 13.48,19.64 | IC2.B3 39.63,5.87 39.9,6.14 42.1,6.14 C34.1 42.25,6.09 42.3,6.14 | 41.65,15.79 41.68,15.81 41.68,17 J2.5 42.01,17.04 44.6,19.63 44.6,25.55 43.81,26.34 | 41.65,15.79 J2.3 | 43.96,29.34 43.91,29.29 R3.1 42.35,29.29 41.17,28.11 40.41,28.11 39.97,28.55 IC3.9 IC3.8 | 43.81,26.34 TP_GND.TP | 4.42,26.46 C38.1 4.46,26.2 4.47,26.2 | 11.57,33.57 C27.1 | 10.26,15.2 10.61,15.2 J1.17 | U1.P$74 26.83,18.16 U1.P$80
  Bottom 0.127: 25.17,11.09 24.41,10.33 v24.41,6.77 21.36,3.72 v14.24,3.72 v5.74,3.72 | 25.17,11.09 25.17,14.27 24.79,14.65 24.79,15.42 | 24.79,15.46 24.79,15.42 | U1.P$87 25.03,15.66 24.79,15.42 | 25.17,11.09 v25.68,10.58 | J4.SH2 18.18,33.86 18.18,29.71 J4.SH4
  pour Route15: -3.22,-2.78 59.43,-2.78 59.42,-2.78 59.42,46.41 59.17,46.66 -3.22,46.66
HAPTIC_EN  (via drill 0.3)
  Top 0.127: v21.86,17.57 22.12,17.57 22.88,16.8 23.01,16.8 23.54,16.27 U1.P$U1 | v29.61,9.57 35.33,9.57 38.52,6.37 IC2.A1
  Route15 0.127: v21.86,17.57 21.86,16.3 22.88,15.28 23.9,15.28 v29.61,9.57
IMU_INT1  (via drill 0.3)
  Top 0.127: v23.01,17.31 U1.P$N1 | IC3.5 38.8,29.83 v36.85,29.83
  Bottom 0.127: v23.01,17.31 23.01,17.57 23.26,17.82 23.26,19.98 33.11,29.83 v36.85,29.83
IMU_INT2  (via drill 0.2, 0.35)
  Top 0.127: v37.7,29.24 38.89,29.24 IC3.6
  Route2 0.127: 24.5,18.54 24.5,20.44 24.7,20.64 28.3,20.64 28.3,22.34 25.6,25.04 v25.3,25.04 | v27.6,27.24 34.3,27.24 34.7,26.84 35,26.84 35.9,27.74 35.9,29.04 36.1,29.24 v37.7,29.24
  Route2 0.152: U1.P$P2 23.5,17.64 23.5,18.54 24.5,18.54
  Bottom 0.127: v25.3,25.04 27.5,27.24 v27.6,27.24
  other vias: 24.08,17.06
LX1
  Top 0.127: IC9.B2 31.61,31.54 31.33,31.54 IC9.B3 31.17,31.38 31.11,31.38 30.37,30.65 30.37,27.94 L7.1
LX2  (via drill 0.3)
  Top 0.127: 31.3,32.3 31.65,32.3 IC9.D2 | 31.3,32.3 31.29,32.3 IC9.D3 | v29.87,30.9 31.2,32.24 | 31.2,32.24 31.26,32.3 | v29.36,28.62 29.36,26.84 29.61,26.58 31.07,26.58 L7.2 | 31.3,32.3 31.24,32.24 31.2,32.24
  Bottom 0.127: v29.87,30.9 29.87,29.12 v29.36,28.62
MOSI  (via drill 0.3, 0.35)
  Top 0.076: 26.83,21.31 U1.P$B13
  Top 0.127: J1.14 10.68,16.74 v12.3,16.74 | v14.3,21.84 15.8,21.84 v16.2,22.24 | v26.8,21.34 26.83,21.31
  Route2 0.127: v16.2,22.24 16.6,22.24 17.4,21.44 24.4,21.44 24.7,21.74 26.4,21.74 v26.8,21.34
  Bottom 0.127: v12.3,16.74 13.9,16.74 13.9,21.84 v14.3,21.84
N$1
  pour Top: -4.77,-4.58 60.47,-4.58 60.72,-4.33 60.72,47.31 60.37,47.66 -4.17,47.66 -5.52,46.31 -5.52,-3.83
N$2
  Top 0.127: IC3.1 40.47,30.14 43.3,30.14 43.51,29.93 R3.2
N$3
  Top 0.127: R9.2 8.93,33.34 7.39,31.79 7.39,30.78 7.35,30.81 IC1.D1
N$4
  Top 0.127: IC9.E1 34.44,32.68 R2.2
N$5
  Top 0.127: IC9.D1 32.12,32.33 33.8,30.65 33.8,29.14 R4.2
N$6
  Top 0.127: U1.P$B3 24.28,20.31 24.28,21.25 23.26,22.27 L2.1
N$7
  Top 0.127: L2.2 23.16,23.28 24.8,23.28 L3.1
N$8
  Top 0.127: C13.1 28.09,21.63 U1.P$A18
N$9
  Top 0.127: U1.P$N24 30.12,17.31 30.94,16.49 C9.1
N$10
  Top 0.127: U1.P$D23 29.58,19.6 29.87,19.6 30.37,20.11 31.19,20.11 C11.1
N$11
  Top 0.127: 30.58,18.38 30.76,18.2 31.54,18.98 C3.1 | 30.58,18.38 30.25,18.71 29.99,18.71 29.97,18.68 29.7,18.68 U1.P$H23 | L1.1 30.58,18.37 30.58,18.38
N$12
  Top 0.127: X1.3 28.26,26.16 30.25,24.17 C2.1 30.25,22.27 29.61,21.63 29.61,20.84 U1.P$A23
N$13  (via drill 0.3)
  Top 0.127: 30.37,20.36 30.76,20.36 31.54,21.15 C1.1 | 30.37,20.36 30.08,20.36 U1.P$B24 | v27.96,24.04 27.07,24.93 26.79,24.93 X1.1 | 30.37,20.36 v30.37,21.63
  Bottom 0.127: v30.37,21.63 v27.96,24.04
N$14  (via drill 0.3)
  Top 0.127: D5.2 9.3,7.03 8,7.03 C2-EP-DR.2 7.95,7.37 7.91,7.41 v6.5,7.41 | v4.72,7.41 1.29,7.41 L5.1
  Bottom 0.127: v4.72,7.41 v6.5,7.41
N$15
  pour Bottom: -8.04,-7.9 -8.02,-7.88 62.92,-7.88 62.92,47.81 62.27,48.46 -5.77,48.46 -8.52,45.71 -8.52,-8.38
N$16  (via drill 0.3)
  Top 0.127: 7.51,5.5 7.51,3.98 7.77,3.72 7.77,1.84 7.79,1.82 Q3.3 | 7.51,5.5 7.51,6.97 C2-EP-DR.1 | v17.67,5.5 17.67,4.46 D4.2 | v17.67,7.03 17.67,7.53 19.22,9.08 D2.1 | v7.64,5.5 7.51,5.5
  Bottom 0.127: v17.67,7.03 v17.67,5.5 v7.64,5.5
N$17
  Top 0.127: R_TYPE_SEL.2 2.04,3.34 3.2,3.34 4.37,2.17 SJ1.2 4.57,2.2 4.85,2.2 6.37,3.72 6.37,4.99 6.88,5.51 R1_EP_DR.1
N$18
  Top 0.127: EPD_C2.2 11.07,21.76 10.62,21.76 J1.4
N$19
  Top 0.127: EPD_C6.2 12.85,20.14 12.85,16.55 11.07,14.77 11.07,14.75 11,14.69 J1.18
N$20
  Top 0.127: EPD_C1.2 12.82,22.39 12.21,22.39 11.07,21.25 10.69,21.25 J1.5
N$21
  Top 0.127: EPD_C7.2 11.07,14.27 10.62,14.27 J1.19
N$22
  Top 0.127: EPD_C8.2 13.14,15.15 12.47,15.15 11.07,13.76 10.69,13.76 J1.20
N$24
  Top 0.127: EPD_C10.2 13.12,13.12 11.45,13.12 11.07,12.74 10.68,12.74 J1.22
N$26
  Top 0.127: EPD_C12.2 11.08,11.21 10.62,11.66 J1.24
N$27
  Top 0.127: C32.2 39.01,6.37 IC2.A2
N$28
  Top 0.127: R1_USB.2 24.15,27.69 24.15,28.23 23.9,28.49 23.9,29.04 J4.A5
N$33
  Top 0.127: R2_USB.1 21.23,27.71 21.23,28.11 20.85,28.49 20.85,29.14 J4.B5
OUT+
  Top 0.127: IC2.A3 39.62,6.39 41.55,6.39 43.98,8.82 TP_OP.TP
OUT-
  Top 0.127: IC2.C3 39.64,5.33 39.64,2.32 TP_ON.TP
P0.00/XL1
  Top 0.127: U1.P$D2 24.04,19.6 23.9,19.6 23.77,19.47 21.48,19.47 21.14,19.82 | 21.14,19.82 20.85,20.11 C17.2 | 21.87,19.15 X2.1 21.14,19.82
P0.01/XL2
  Top 0.127: U1.P$F2 24.05,19.09 23.77,19.09 23.64,19.22 22.88,19.22 21.23,17.57 21.23,16.65 X2.2 21.06,16.57 C18.2
P0.13  (via drill 0.3)
  Top 0.127: 13.1,6.9 12.21,6.9 11.21,5.9 11.13,5.9 R5.1 10.82,5.63 10.44,5.25 10.44,4.87 10.56,4.74 10.56,4.06 SW_UP.2 | 13.1,6.9 15.26,6.9 18.31,9.95 24.41,9.95 26.06,11.6 26.06,13.12 25.68,13.5 25.68,14.31 U1.P$AD8 | v13.74,6.14 13.74,5.62 C30.2 | 13.1,6.9 v13.1,6.77
  Bottom 0.127: v13.1,6.77 v13.74,6.14
P0.14  (via drill 0.3)
  Top 0.127: v25.29,14.77 25.83,14.77 U1.P$AC9 | 24.79,5.88 24.87,5.97 | 24.87,5.97 v25.17,6.26 | v25.17,7.53 23.9,7.53 22.12,5.76 21.46,5.76 R8.1 | v23.9,5.38 22.63,5.38 21.74,4.49 21.74,4 SW_ENT.2 | 24.87,5.97 24.87,5.88 C31.2
  Bottom 0.127: v25.29,14.77 25.29,14.52 25.8,14.01 25.8,11.09 26.18,10.71 26.18,7.28 25.8,6.9 | 25.8,6.9 v25.17,6.26 24.28,5.38 v23.9,5.38 | 25.8,6.9 v25.17,7.53
P1.01  (via drill 0.3)
  Top 0.127: v29.48,14.77 29.48,15.56 U1.P$Y23 | v24.66,11.22 21.23,11.22 20.07,12.38 R_PWR_EPD.1 19.83,12.55 19.81,12.53 19.39,12.53 19.17,12.75 19.17,13.3 Q1.1
  Route2 0.127: v29.48,14.77 29.23,14.77 25.68,11.22 v24.66,11.22
P1.02  (via drill 0.3)
  Top 0.127: v31.53,15.79 30.1,15.79 U1.P$W24 | 32.53,6.01 32.53,5.71 R7.1 | 32.53,6.01 v32.53,6.52 | 32.53,6.01 33.04,6.01 | 33.04,6.01 35.65,6.01 35.74,5.91 C29.2 | 33.04,6.01 33.04,4.99 32.66,4.61 32.66,3.97 SW_DN.2
  Bottom 0.127: v31.53,15.79 31.53,11.59 32.53,10.58 v32.53,6.52
PMIC_INT  (via drill 0.3)
  Top 0.127: v24.02,16.04 24.02,16.56 U1.P$T2 | v8.66,28.36 7.39,29.63 7.37,29.61 IC1.A1
  Bottom 0.127: v24.02,16.04 24.02,15.66 23.14,14.77 23.14,13.12 23.39,12.87 23.39,12.61 23.01,12.23 21.86,12.23 15.01,19.09 15.01,22.01 v8.66,28.36
PREVGH
  Top 0.127: 10.89,13.25 11,13.25 | 11,13.25 11.07,13.25 11.96,14.14 13.11,14.14 EPD_C9.2 | D5.1 13.57,7.83 10.05,11.34 10.05,13 10.18,13.12 10.24,13.12 10.24,13.13 10.3,13.19 J1.21 10.7,13.19 10.82,13.19 10.94,13.19 11,13.25
PREVGL
  Top 0.127: 13.48,11.98 13.48,12.27 EPD_C11.2 | 13.48,11.98 13.36,11.85 11.61,11.85 11.61,11.93 11.35,12.19 J1.23 | 13.48,11.98 15.64,9.82 15.64,9.18 D2.2
RESE  (via drill 0.3)
  Top 0.127: 7.13,3.22 7.13,3.94 | 7.13,3.94 7.13,4.36 | 7.13,4.36 7.13,4.96 R1_EP_DR.2 | v9.16,21.12 10.18,22.14 10.57,22.14 J1.3 | 7.13,4.36 v7.01,4.36 | 7.13,3.94 7.14,3.93 Q3.2
  Bottom 0.127: v9.16,21.12 9.16,9.69 7.01,7.53 v7.01,4.36
RESET  (via drill 0.2, 0.3, 0.35)
  Top 0.127: v38.88,18.2 40.03,17.06 40.34,17.06 J2.6 | 38.88,20.44 38.88,21.89 TP_RESET.TP | 38.88,20.44 v38.88,19.6 | 38.88,20.44 38.3,19.86 38.3,18.84 35.3,15.84 v32.5,15.84
  Route2 0.127: v32.5,15.84 31.8,15.14 29.9,15.14 29.7,15.34 29.7,15.44 29.2,15.44 28.8,15.04 27.1,15.04 26.87,14.81 U1.P$AC13
  Bottom 0.127: v38.88,19.6 v38.88,18.2
  other vias: 26.83,14.81
RF  (via drill 0.3)
  Top 0.127: 33.42,17.95 33.42,18.22 C4.1 | 33.42,17.95 C22.1 | 33.42,17.95 32.12,17.95 L1.2 32.06,17.76 v31.39,17.09 | v29.74,4.74 28.98,4.74 28.44,4.2 ANT1.1
  Bottom 0.127: v31.39,17.09 29.59,15.28 29.36,15.28 28.98,14.9 28.98,5.5 v29.74,4.74
SCK  (via drill 0.3)
  Top 0.127: v25.04,21.12 26.31,21.12 26.58,20.85 U1.P$A12 | v12.35,17.59 12.07,17.31 10.62,17.31 J1.13
  Route2 0.127: v25.04,21.12 12.95,21.12 12.95,21.09 12.6,20.74 11.5,20.74 11.3,20.54 11.3,18.65 v12.35,17.59
SCL  (via drill 0.2, 0.3, 0.35)
  Top 0.127: v10.56,31.79 8.78,30.01 7.39,30.01 7.38,30.01 IC1.B1 | v16.4,32.68 15.63,32.68 U3.7 | R17.2 35.12,29.51 34.16,28.56 33.8,28.56 | v38.5,4.87 38.63,4.99 38.63,5.34 IC2.C1 | TP_SCL.TP 40.79,26.37 v40.79,24.81 40.03,24.81 39.14,23.92 39.14,23.41 37.74,22.01 36.85,22.01 35.76,23.1 33.8,25.06 33.8,28.56 | v41.04,29.63 40.5,29.63 IC3.12 | 33.8,28.56 R4.1
  Top 0.152: v34.7,17.64 34.7,22.04 35.76,23.1
  Route2 0.15: U1.P$M2 34.62,17.56
  Route2 0.152: 34.62,17.56 v34.7,17.64
  Route15 0.127: v16.4,32.68 16.79,32.68 17.93,31.54 32.79,31.54 33.86,30.47 40.21,30.47 v41.04,29.63
  Bottom 0.127: v10.56,31.79 15.52,31.79 v16.4,32.68 | v38.5,4.87 38.5,11.09 40.15,12.74 40.15,17.31 40.79,17.95 v40.79,24.81 40.53,25.06 40.53,28.74 41.04,29.25 v41.04,29.63
  other vias: 24.08,17.56
SDA  (via drill 0.3, 0.35)
  Top 0.127: v34.82,27.6 34.5,27.6 34.42,27.53 R18.2 | 39.87,29.98 39.81,29.93 | 39.81,29.93 v39.52,29.63 | v22.5,18.2 22.88,17.82 23.57,17.82 U1.P$L1 | v17.17,33.19 15.63,33.19 U3.8 | v7.89,30.52 7.77,30.39 7.39,30.39 7.37,30.41 IC1.C1 | v33.8,33.19 34.36,33.19 34.34,33.2 R2.1 | v38.76,33.7 38.88,33.57 40.08,33.57 TP_SDA.TP | v40.03,31.28 40.03,30.22 IC3.2 39.81,30.06 39.81,29.93
  Top 0.152: v41.9,33.14 41.52,33.52 TP_SDA.TP
  Bottom 0.127: v34.82,27.6 37.49,27.6 v39.52,29.63 | 22.5,23.66 22.5,23.79 17.17,29.12 17.17,30.39 | 22.5,23.66 v22.5,18.2 | v17.17,33.19 17.17,30.39 | v7.89,30.52 16.15,30.52 16.28,30.39 17.17,30.39 | 22.5,23.66 27.71,28.87 27.71,30.27 30.63,33.19 v33.8,33.19 34.31,33.7 v38.76,33.7 40.03,32.43 v40.03,31.28
  Bottom 0.152: IC2.B2 40.47,7.24 45.6,7.24 45.6,28.74 44.1,30.24 44.1,32.24 43.2,33.14 v41.9,33.14
  other vias: 39.1,5.87
SWDCLK
  Top 0.127: 40.28,19.22 39.14,19.22 35.2,15.28 30.11,15.28 U1.P$AA24 | 40.28,19.22 41.04,18.46 41.04,16.33 40.92,16.33 J2.4 | 40.28,19.22 43.33,22.27 43.33,23.34 TP_SWDCLK.TP
SWDIO
  Top 0.127: U1.P$AC24 30.22,14.67 33.89,14.67 TP_SWDIO.TP 35.29,14.77 39.01,14.77 39.29,14.5 J2.2
SWO  (via drill 0.3)
  Top 0.127: v29.61,13.76 29.08,14.29 U1.P$AD22 | v30.76,11.73 34.2,11.73 TP_SWO.TP
  Bottom 0.127: v29.61,13.76 29.61,12.87 v30.76,11.73
VBAT
  Top 0.127: U3.3 13.74,32.23 13.74,32.73 U3.2 13.66,32.81 13.23,32.81 12.82,33.22 C27.2 10.15,33.22 9.29,34.08 7.77,34.08 6.75,33.06 5.48,33.06 C37.2 | 5.48,31.79 6.88,30.39 6.91,30.39 IC1.C2 | C37.2 5.48,31.79 | C37.2 | TP_VBAT.TP 3.55,31.48 5.17,31.48 5.48,31.79
VBUS  (via drill 0.3)
  Top 0.127: C42.2 29.23,30.82 29.23,29.35 C43.1 29.1,29.29 29.1,29 28.47,28.36 v26.44,28.36 | v25.29,28.11 25.29,28.36 25.04,28.62 25.04,29.14 J4.A4_B9 | 4.85,26.46 4.91,26.53 | 4.91,26.53 6.88,28.49 v6.88,28.87 6.88,29.63 6.9,29.61 IC1.A2 | U1.P$AD2 24.02,14.31 24.02,12.72 C21.1 23.92,12.74 v22.88,12.74 | v18.82,16.3 18.82,25.11 16.45,27.47 15.85,27.47 D3.5 15.81,27.6 15.39,27.6 15.01,27.98 15.01,28.87 15.13,29 15.52,29 17.55,31.03 19.83,31.03 20.34,30.52 20.34,30.01 20.21,29.89 20.21,29.2 J4.A9_B4 20.21,29.07 | v20.59,28.11 20.21,28.49 20.21,29.07 | 20.21,29.12 20.21,29.07 | 4.91,26.53 4.91,26.49 C38.2
  Bottom 0.127: v26.44,28.36 25.55,28.36 v25.29,28.11 v20.59,28.11 | v22.88,12.74 22.37,12.74 v18.82,16.3 18.18,16.3 17.57,16.91 17.57,20.08 8.78,28.87 v6.88,28.87
VBUS/2.6D1  (via drill 0.3)
  Top 0.127: v23.64,14.65 24.15,14.65 24.28,14.77 24.79,14.77 U1.P$AC5 | C20.1 24.53,13.18 v24.53,13.76
  Bottom 0.127: v24.53,13.76 v23.64,14.65
VREG  (via drill 0.3)
  Top 0.127: C39.1 1.86,28.01 3.86,30.01 v6.37,30.01 IC1.B2 | IC9.A3 31.37,31.08 31.45,31.16 31.67,31.16 IC9.A2 IC9.A1 32.17,31.08 32.41,30.84 v32.41,30.65 | v29.61,32.81 29.21,32.41 29.08,32.41 C23.2 | v30.37,33.57 33.55,33.57 33.68,33.7 34.69,33.7 34.82,33.57 34.82,32.55 | 34.82,32.55 34.82,32.43 34.31,31.92 34.31,31.64 C24.2 34.16,31.64 33.78,31.64 v33.68,31.54 | 34.82,32.55 37.52,32.55 TP_VREG.TP
  Route2 0.127: v6.37,30.01 7.51,30.01 7.64,29.89 9.16,29.89 10.18,30.9 15.52,30.9 17.17,32.55 29.36,32.55 v29.61,32.81
  Bottom 0.127: v30.37,33.57 v29.61,32.81 | v32.41,30.65 32.79,30.65 v33.68,31.54